# EasyEDA schematic EasyEDA_SmartMeter-Reader.json
TITLE: SmartMeter-ESP32; REV: 1.0; Date: 2025-03-09; Sheet: 1/1; Drawn By: TheRealTurtler; Company: ---
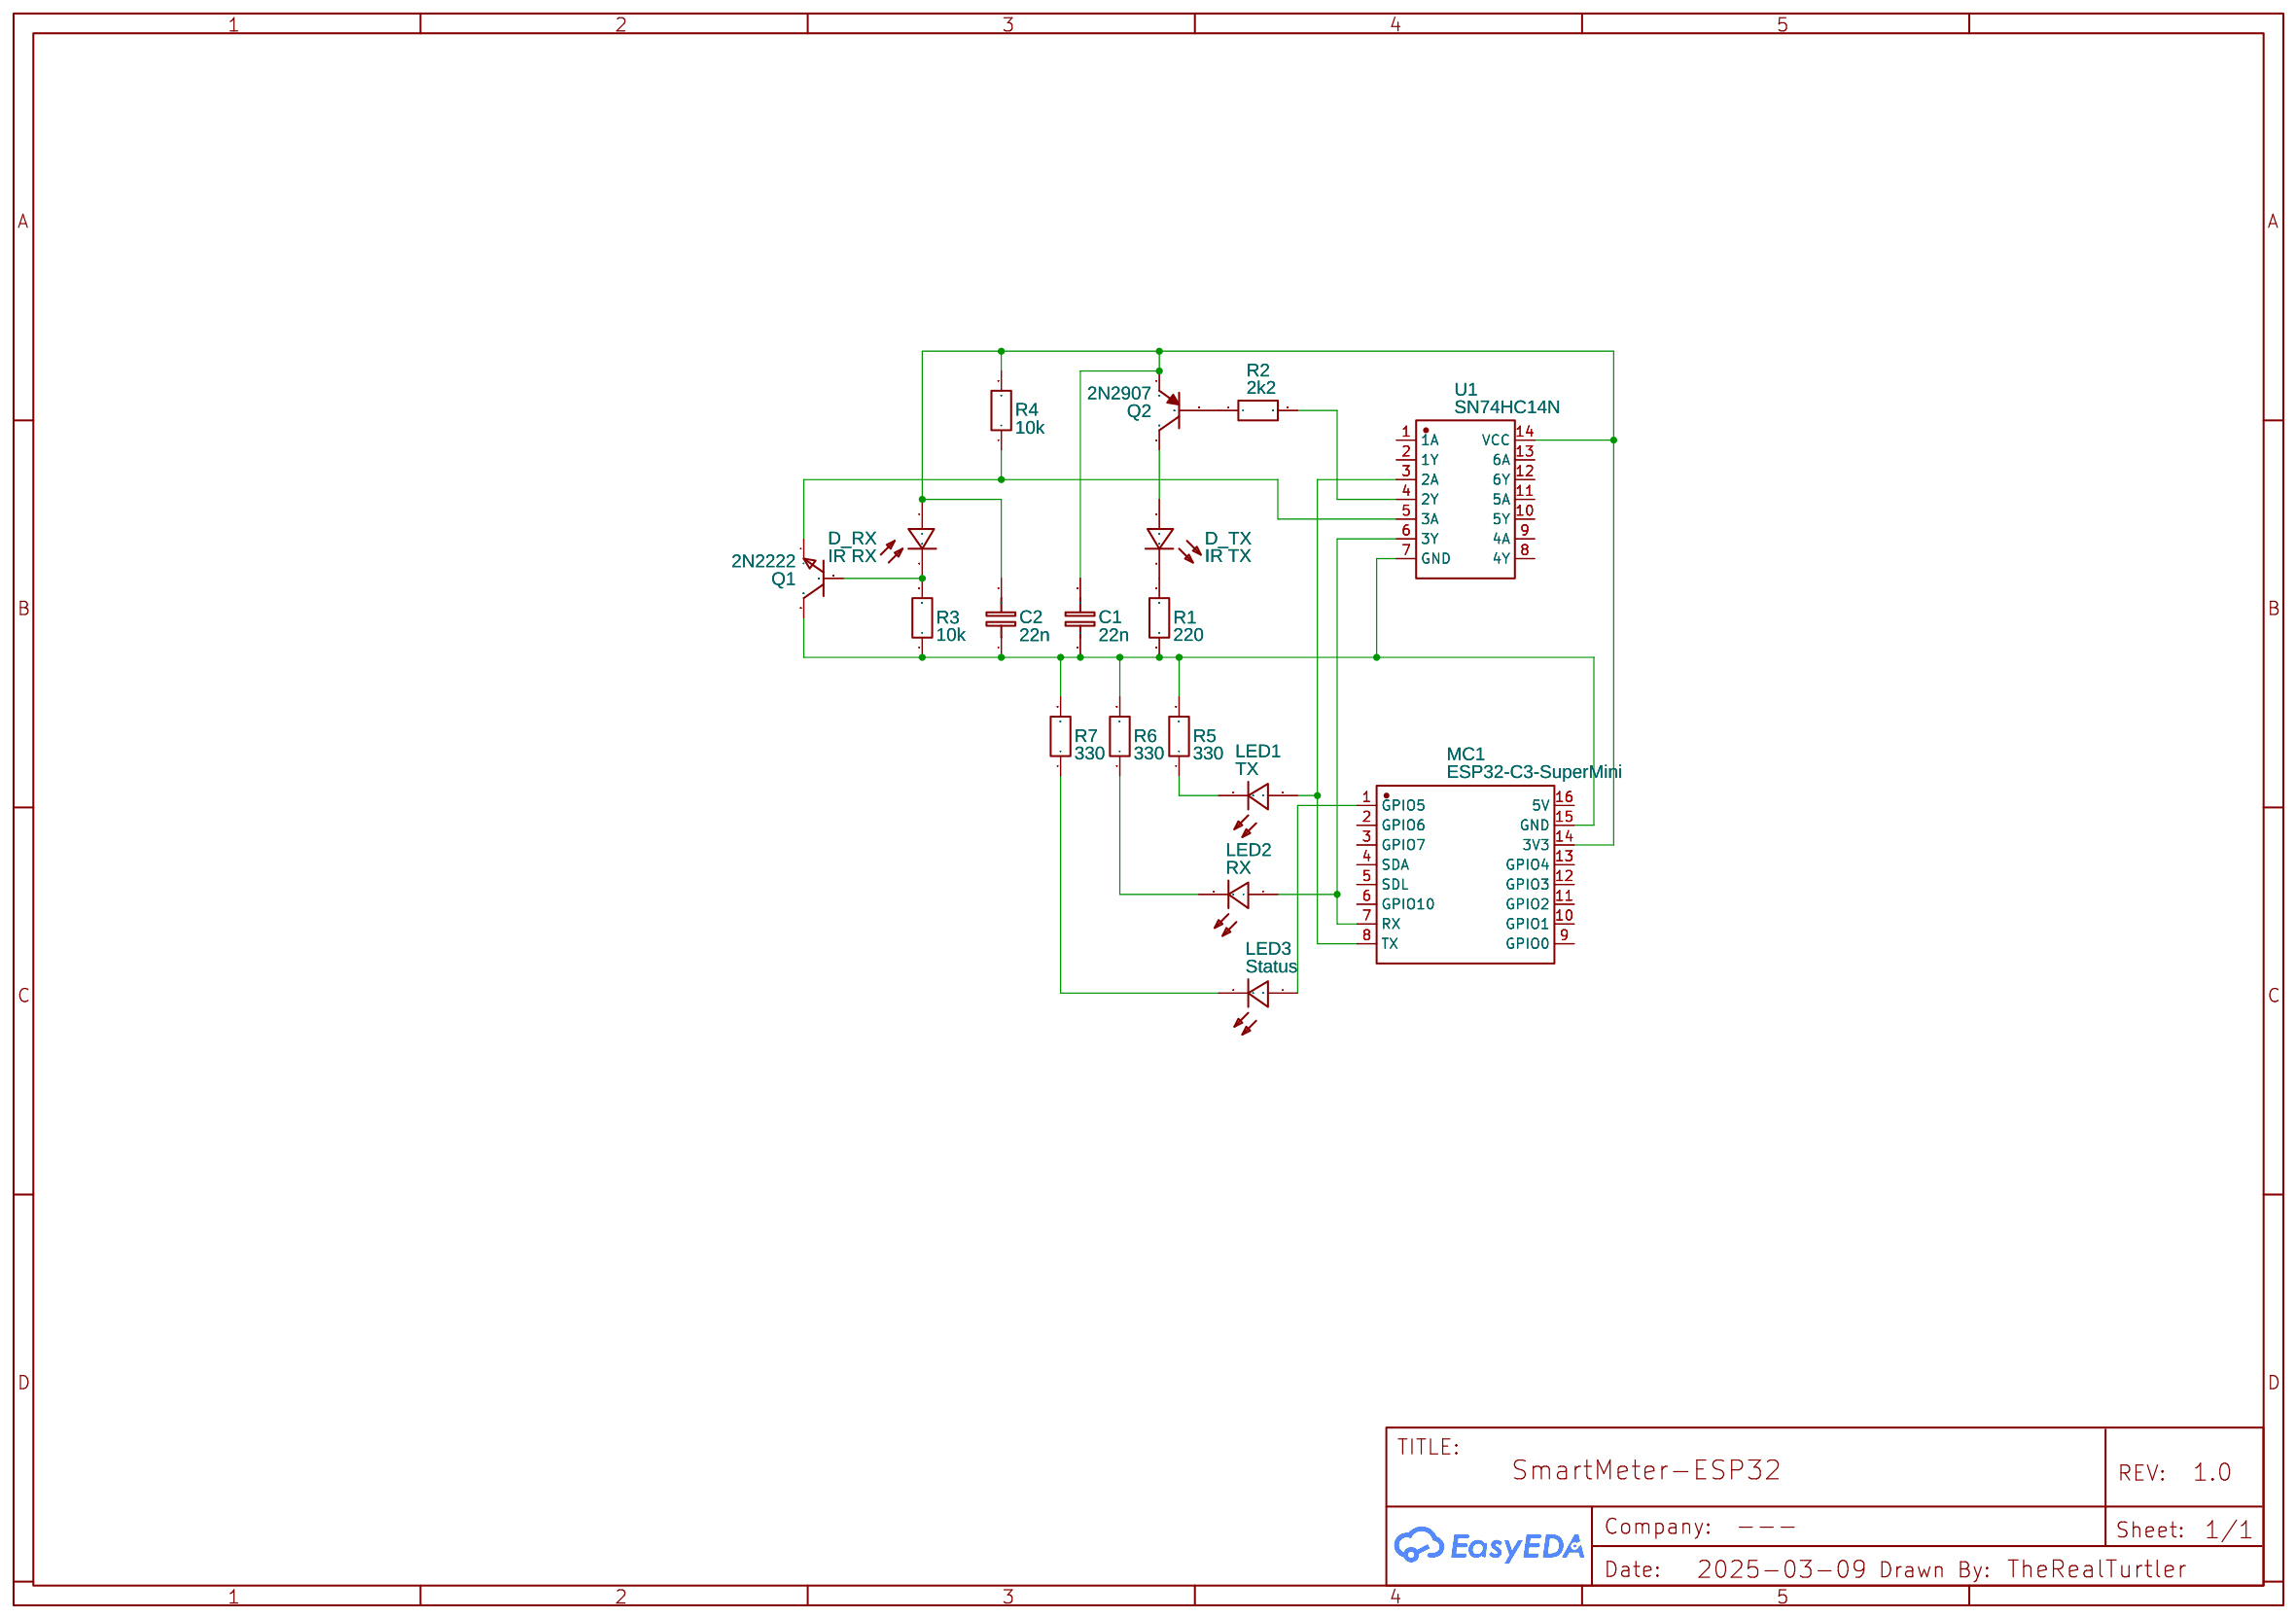
[diagram p0: schematic sheet]

## Parts
C1  22n  [CAP-TH_L11.7-W5.7-P7.50-D0.8]
C2  22n  [CAP-TH_L11.7-W5.7-P7.50-D0.8]
D_RX  IR RX  [LED-TH_BD5.4-P2.54-FD_RED]
D_TX  IR TX  [LED-TH_BD5.4-P2.54-FD_RED]
LED1  TX  [LED-TH_BD5.4-P2.54-FD_RED]
LED2  RX  [LED-TH_BD5.4-P2.54-FD_RED]
LED3  Status  [LED-TH_BD5.4-P2.54-FD_RED]
MC1  ESP32-C3-SuperMini  [ESP23-C3]
Q1  2N2222  [TO-92-3_L4.9-W3.7-P1.27-L]
Q2  2N2907  [TO-92-3_L5.1-W4.1-P1.27-L]
R1  220  [R-THT0207-10]
R2  2k2  [R-THT0207-10]
R3  10k  [R-THT0207-10]
R4  10k  [R-THT0207-10]
R5  330  [R-THT0207-10]
R6  330  [R-THT0207-10]
R7  330  [R-THT0207-10]
U1  SN74HC14N  [DIP-14_L19.2-W6.6-P2.54-LS10.9-BL]

## Library data of the parts
C1 C2 = C_0603_EU: Contributor: LCEDA_Lib
D_RX = Photodiode 3mm: Contributor: therealturtler
D_TX LED1-LED3 = LED-TH-3MM_R: Contributor: LCSC; Supplier: LCSC; Supplier Part: C9900003210; Manufacturer: null; Manufacturer Part: LED-TH-3mm_R; JLCPCB Part Class: Extended Part
MC1 = ESP32-C3-SuperMini: Contributor: therealturtler
Q1 = 2N2222: Contributor: LCSC; Supplier: LCSC; Manufacturer: ST(先科); Manufacturer Part: 2N2222A; Supplier Part: C118536; JLCPCB Part Class: Extended Part
Q2 = 2N2907: Supplier: LCSC; Manufacturer: ST(先科); Manufacturer Part: 2N2907A; Supplier Part: C118537; JLCPCB Part Class: Extended Part
R1-R7 = R_0603_EU: Contributor: LCEDA_Lib
U1 = SN74HC14N: Supplier: LCSC; Manufacturer: TI(德州仪器); Supplier Part: C2907; JLCPCB Part Class: Extended Part

## Nets
Net-(C1-1): C1.1 C2.1 MC1.15(GND) Q1.3(C) R1.1 R3.1 R5.2 R6.2 R7.2 U1.7(GND)
Net-(C1-2): C1.2 C2.2 D_RX.1 MC1.14(3V3) Q2.1(E) R4.2 U1.14(VCC)
Net-(D_RX-2): D_RX.2 Q1.2(B) R3.2
Net-(D_TX-1): D_TX.1 Q2.3(C)
Net-(D_TX-2): D_TX.2 R1.2
Net-(LED1-1): LED1.1 MC1.8(TX) U1.3(2A)
Net-(LED1-2): LED1.2 R5.1
Net-(LED2-1): LED2.1 MC1.7(RX) U1.6(3Y)
Net-(LED2-2): LED2.2 R6.1
Net-(LED3-1): LED3.1 MC1.1(GPIO5)
Net-(LED3-2): LED3.2 R7.1
Net-(Q1-1): Q1.1(E) R4.1 U1.5(3A)
Net-(Q2-2): Q2.2(B) R2.1
Net-(R2-2): R2.2 U1.4(2Y)

Not connected (* = marked no-connect by the designer): MC1 2(GPIO6) 3(GPIO7) 4(SDA) 5(SDL) 6(GPIO10) 9(GPIO0) 10(GPIO1) 11(GPIO2) 12(GPIO3) 13(GPIO4) 16(5V); U1 1(1A) 2(1Y) 8(4Y) 9(4A) 10(5Y) 11(5A) 12(6Y) 13(6A)
